# Altium schematic sheet 教育无人机.SchDoc
size A4
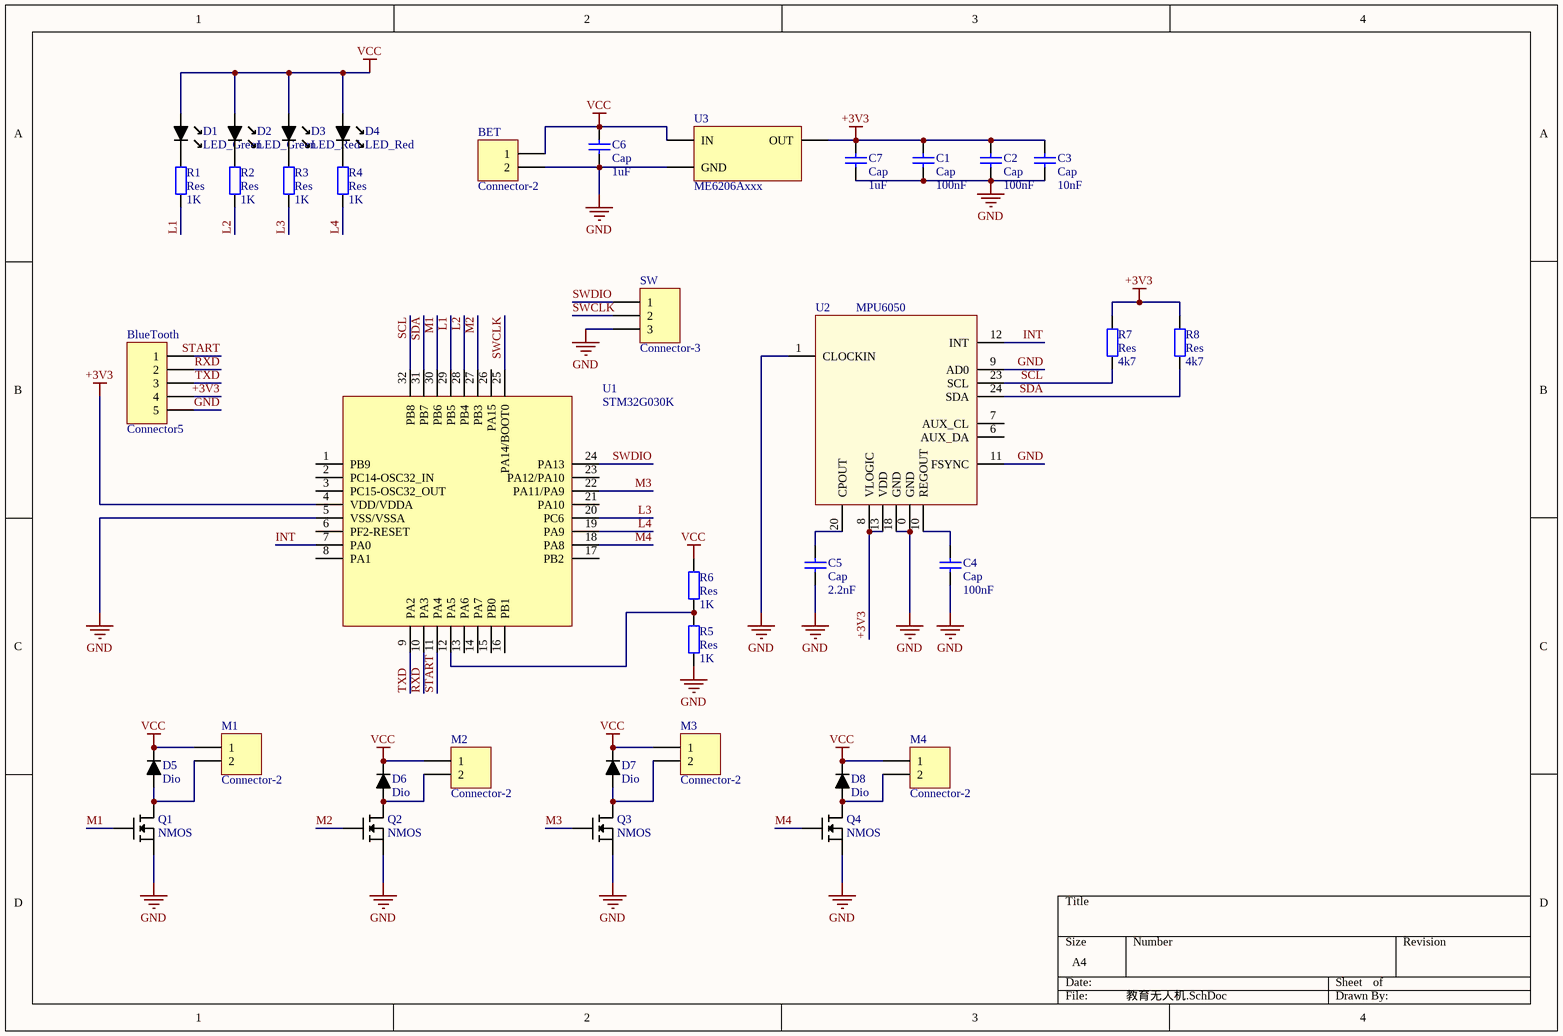
[diagram p0: 教育无人机.SchDoc]

## Parts
BET  Connector-2  [XH2.54TH-2]
BlueTooth  Connector5  [2.54th5]
C1  Cap  value 100nF  [1206m]
C2  Cap  value 100nF  [1206m]
C3  Cap  value 10nF  [1206m]
C4  Cap  value 100nF  [1206m]
C5  Cap  value 2.2nF  [1206m]
C6  Cap  value 1uF  [1206m]
C7  Cap  value 1uF  [1206m]
D1  LED_Green  [D0805M]
D2  LED_Green  [D0805M]
D3  LED_Red  [D0805M]
D4  LED_Red  [D0805M]
D5  Dio  [DO-214ACM]
D6  Dio  [DO-214ACM]
D7  Dio  [DO-214ACM]
D8  Dio  [DO-214ACM]
M1  Connector-2  [XH2.54TH-2]
M2  Connector-2  [XH2.54TH-2]
M3  Connector-2  [XH2.54TH-2]
M4  Connector-2  [XH2.54TH-2]
Q1  NMOS  [SOT23-3M]
Q2  NMOS  [SOT23-3M]
Q3  NMOS  [SOT23-3M]
Q4  NMOS  [SOT23-3M]
R1  Res  value 1K  [1206M]
R2  Res  value 1K  [1206M]
R3  Res  value 1K  [1206M]
R4  Res  value 1K  [1206M]
R5  Res  value 1K  [LC-0805_R]
R6  Res  value 1K  [LC-0805_R]
R7  Res  value 4k7  [LC-0805_R]
R8  Res  value 4k7  [LC-0805_R]
SW  Connector-3  [XH2.54TH-3]
U1  STM32G030K  [LQFP32M]
U2  MPU6050  [QFN4*4-24M]
U3  ME6206Axxx  [sot89m]

## Nets
+3V3: BlueTooth.4 C1.1 C2.1 C3.1 C7.1 R7.2 R8.2 U1.4(VDD/VDDA) U2.8(VLOGIC) U2.13(VDD) U3.OUT
GND: BET.2 BlueTooth.5 C1.2 C2.2 C3.2 C4.2 C5.2 C6.2 C7.2 Q1.S Q2.S Q3.S Q4.S R5.1 SW.3 U1.5(VSS/VSSA) U2.0(GND) U2.1(CLOCKIN) U2.9(AD0) U2.11(FSYNC) U2.18(GND) U3.GND
VCC: BET.1 C6.1 D1.A D2.A D3.A D4.A D5.K D6.K D7.K D8.K M1.1 M2.1 M3.1 M4.1 R6.2 U3.IN
INT: U1.7(PA0) U2.12(INT)
L1: R1.1 U1.29(PB5)
L2: R2.1 U1.28(PB4)
L3: R3.1 U1.20(PC6)
L4: R4.1 U1.19(PA9)
M1: Q1.G U1.30(PB6)
M2: Q2.G U1.27(PB3)
M3: Q3.G U1.22(PA11/PA9)
M4: Q4.G U1.18(PA8)
RXD: BlueTooth.2 U1.10(PA3)
SCL: R7.1 U1.32(PB8) U2.23(SCL)
SDA: R8.1 U1.31(PB7) U2.24(SDA)
START: BlueTooth.1 U1.11(PA4)
SWCLK: SW.2 U1.25(PA14/BOOT0)
SWDIO: SW.1 U1.24(PA13)
TXD: BlueTooth.3 U1.9(PA2)
NetC4_1: C4.1 U2.10(REGOUT)
NetC5_1: C5.1 U2.20(CPOUT)
NetD1_K: D1.K R1.2
NetD2_K: D2.K R2.2
NetD3_K: D3.K R3.2
NetD4_K: D4.K R4.2
NetD5_A: D5.A M1.2 Q1.D
NetD6_A: D6.A M2.2 Q2.D
NetD7_A: D7.A M3.2 Q3.D
NetD8_A: D8.A M4.2 Q4.D
NetR5_2: R5.2 R6.1 U1.12(PA5)

Not connected (* = marked no-connect by the designer): U1 1(PB9) 2(PC14-OSC32_IN) 3(PC15-OSC32_OUT) 6(PF2-RESET) 8(PA1) 13(PA6) 14(PA7) 15(PB0) 16(PB1) 17(PB2) 21(PA10) 23(PA12/PA10) 26(PA15); U2 6(AUX_DA) 7(AUX_CL)

## Library data of the parts
C1-C7 = Cap: Capacitor; Published: 8-Jun-2000; LatestRevisionDate: 17-Jul-2002; LatestRevisionNote: Re-released for DXP Platform.; PackageReference: RAD-0.3; Publisher: Altium Limited; PackageDescription: Radial Cap, Thru-Hole; 2 Leads; 0.3 in Pin Spacing
D1-D4 = LED
Q1-Q4 = NMOS: pin to pad: D>3 G>1 S>2
R1-R8 = Res: Resistor; Published: 8-Jun-2000; LatestRevisionDate: 17-Jul-2002; LatestRevisionNote: Re-released for DXP Platform.; PackageReference: AXIAL-0.4; Publisher: Altium Limited; PackageDescription: Axial Device, Thru-Hole; 2 Leads; 0.4 in Pin Spacing
U3 = ME6206Axxx: pin to pad: GND>1 IN>2 OUT>3